# EasyEDA Pro project cartridge.epro

# Schematic Schematic1
Board Name: Board1; Create Date: 2025-01-17; Page Name: P1; Project Name: cartridge; Schematic Name: Schematic1; Update Date: 2025-01-17; Company: EasyEDA.com; Drawn: EasyEDA; Page Size: A4; Part Number: JLCPCB-002; Reviewed: EasyEDA; Version: V0.1
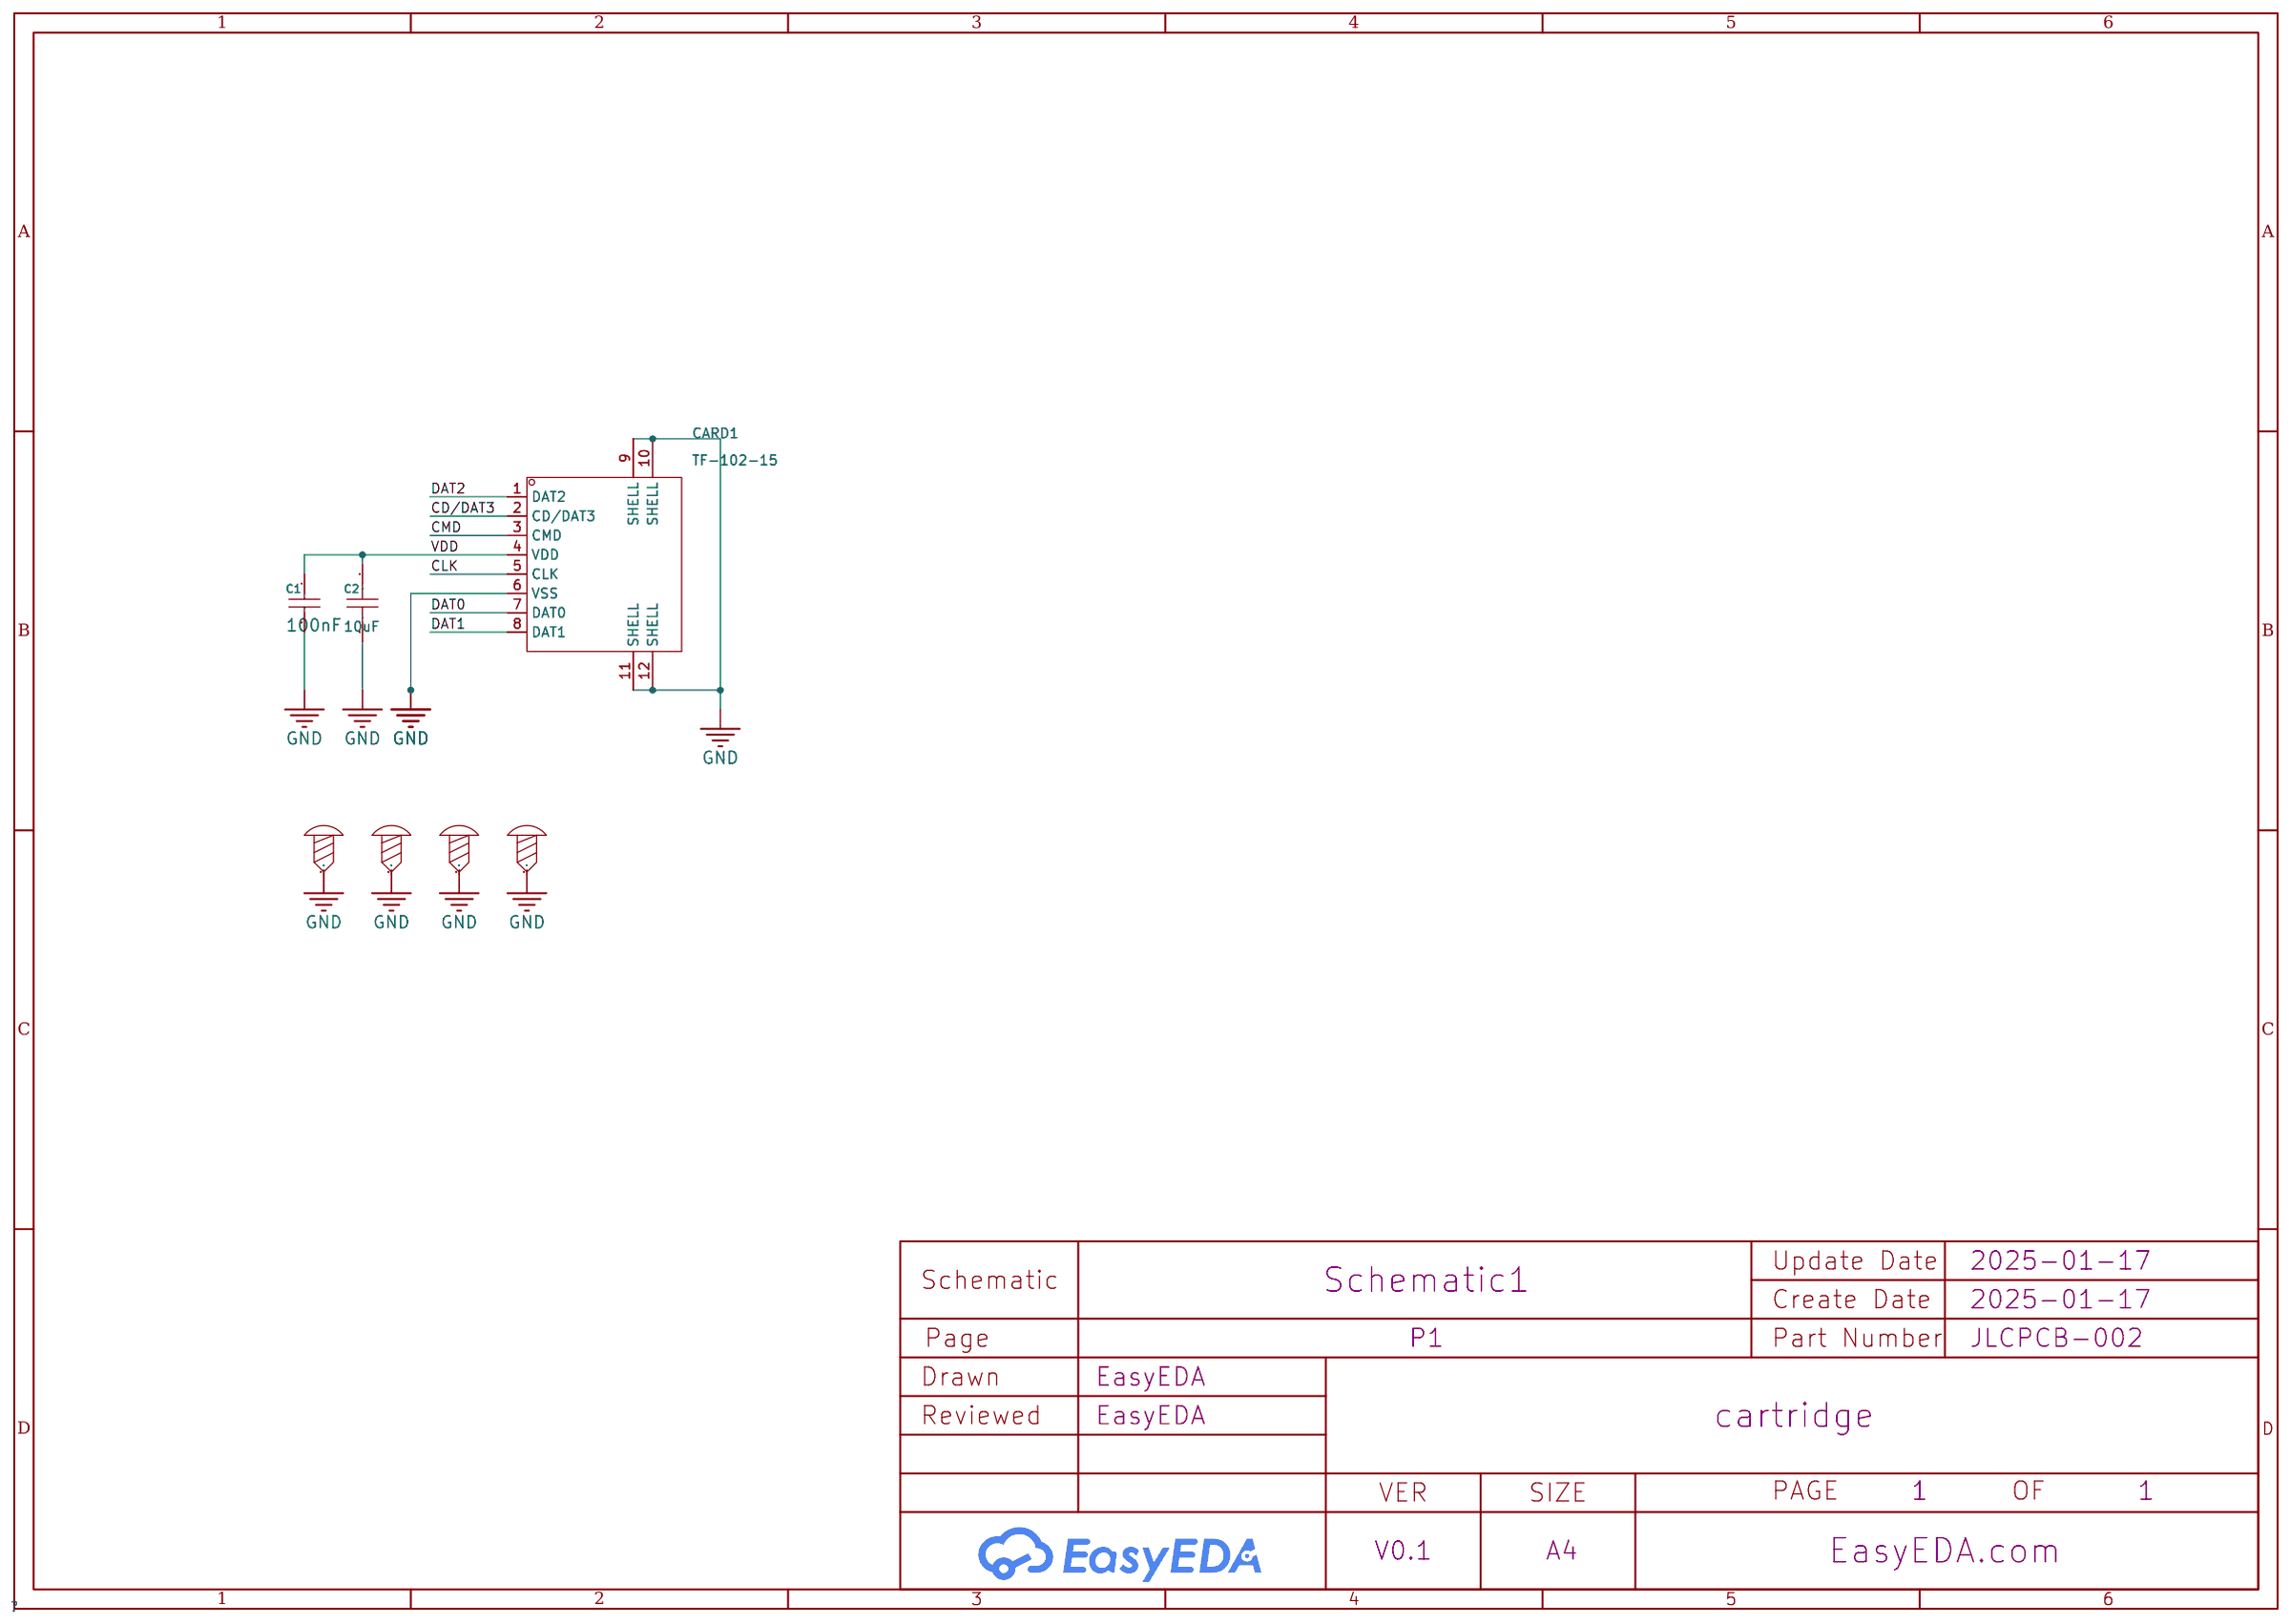
[diagram p0: schematic sheet]

## Parts
C1  100nF  [C0805]
C2  10uF  [C0805]
CARD1  TF-102-15  [TF-SMD_TF-102-15]
SCREW1  -  [Screw-Hole-M2]
SCREW2  -  [Screw-Hole-M2]
SCREW3  -  [Screw-Hole-M2]
SCREW4  -  [Screw-Hole-M2]

## Library data of the parts
C1 = CL21B104KBCNNNC: Capacitance: Tolerance:±10% Tolerance:±10% Voltage Rated: Temperature Coefficient:; LCSC Part Name: 100nF ±10% 50V; Supplier Part: C1711; Manufacturer: SAMSUNG(三星); Supplier Footprint: 0805; JLCPCB Part Class: Extended Part; Datasheet: https://atta.szlcsc.com/upload/public/pdf/source/20160218/1457707763339.pdf; Supplier: LCSC; Tolerance: ±10%
C2 = CL21A106KAYNNNE_C15850: Capacitance: Tolerance:±10% Tolerance:±10% Voltage Rated: Temperature Coefficient:; LCSC Part Name: 10uF ±10% 25V; Supplier Part: C15850; Manufacturer: SAMSUNG(三星); Manufacturer Part: CL21A106KAYNNNE; Supplier Footprint: 0805; JLCPCB Part Class: Basic Part; Datasheet: https://atta.szlcsc.com/upload/public/pdf/source/20160218/1457707763339.pdf; Supplier: LCSC; Tolerance: ±10%
CARD1 = TF-102-15: Card Connection Mode:Flip type Card Type:MicroSD card (TF card) Connector Type:Card Slot Additional Card Detection Pins:- Supplementary Features:- Maximum Body Height:1.6mm Operating Temperature Range:-25℃~+85℃ Operating Temperature Range:-25℃~+85℃; LCSC Part Name: 翻盖式 MicroSD卡(TF卡) 卡座; Supplier Part: C266609; Manufacturer: XUNPU(讯普); Supplier Footprint: SMD; JLCPCB Part Class: Extended Part; Datasheet: https://atta.szlcsc.com/upload/public/pdf/source/20210906/0DFE5F37C5A4FEB0620878352EFBDEA1.pdf; Supplier: LCSC; Card Connection Mode: Flip type; Card Type: MicroSD card (TF card); Connector Type: Card Slot; Maximum Body Height: 1.6mm; Operating Temperature Range: -25℃~+85℃
SCREW1-SCREW4 = Screw-Hole-M2: Supplier Footprint: 插件

## Nets
GND: C1.2 C2.1 CARD1.6(VSS) CARD1.9(SHELL) CARD1.10(SHELL) CARD1.11(SHELL) CARD1.12(SHELL) SCREW1.1 SCREW2.1 SCREW3.1 SCREW4.1
VDD: C1.1 C2.2 CARD1.4(VDD)
CD/DAT3: CARD1.2(CD/DAT3)
CLK: CARD1.5(CLK)
CMD: CARD1.3(CMD)
DAT0: CARD1.7(DAT0)
DAT1: CARD1.8(DAT1)
DAT2: CARD1.1(DAT2)

# Board PCB1
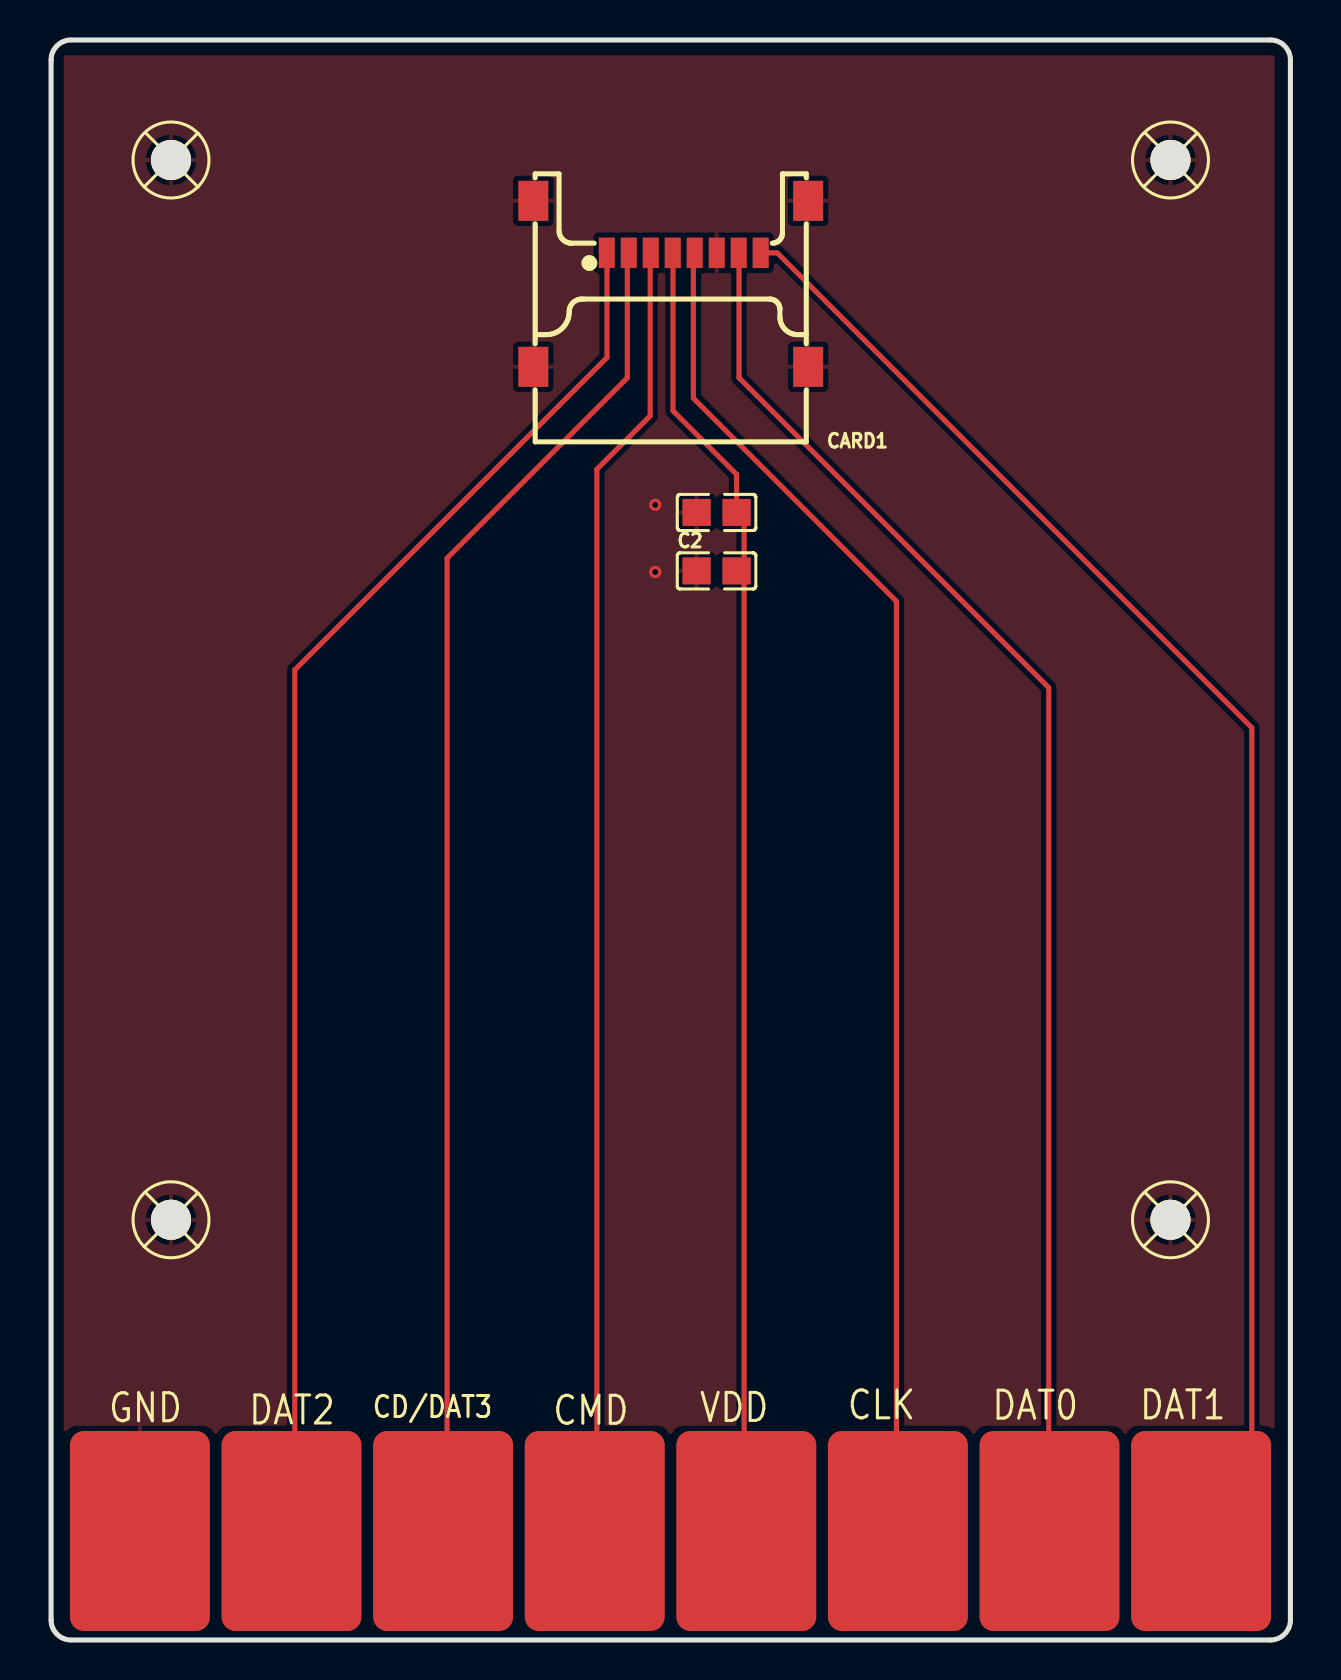
[diagram p1: board, top side]
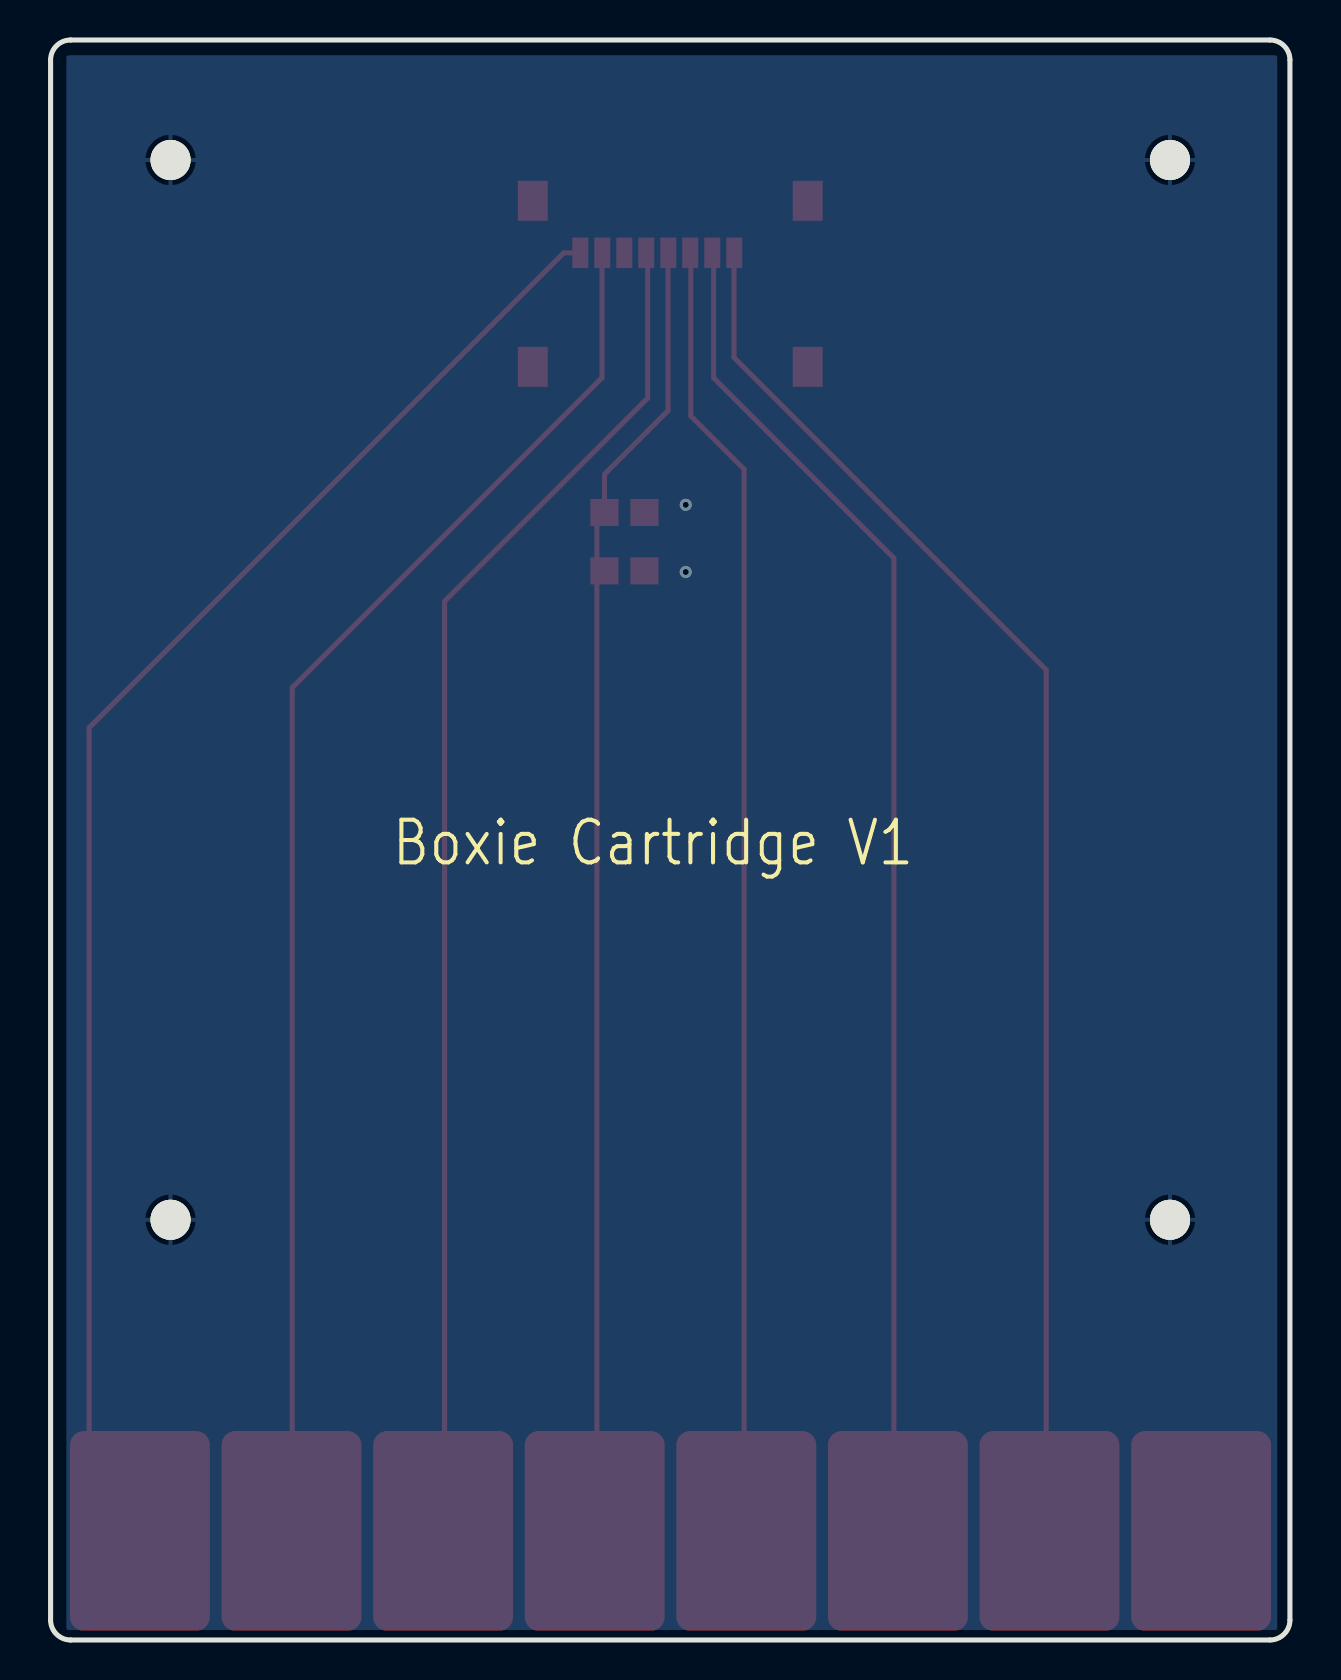
[diagram p2: board, bottom side, seen from below]

Outline 62 x 80 mm; copper layers: Top Layer, Bottom Layer. Coordinates in mm from the lower left corner of the outline.
Outline path: 0,79 0,1 arc(0.29,0.29) 1,0 61,0 arc(61.71,0.29) 62,1 62,79 arc(61.71,79.71) 61,80 1,80 arc(0.29,79.71) 0,79
Stack: Top Layer 0.035mm / Dielectric1 1.51mm FR4 er 4.5 / Bottom Layer 0.035mm

## Design rules (mm)
template: Custom Config
spacing copperThickness1oz (default): track to track 0.102, other pairs 0.152 to 0.3
spacing copperThickness2oz: track to track 0.203, other pairs 0.152 to 0.3
track width copperThickness1oz (default): min 0.127, default 0.254, max 2.54
track width copperThickness2oz: min 0.203, default 0.254, max 2.54
differential pair differentialPair (default): width min 0.127, default 0.254, max 2.54; gap min 0.152, default 0.152
via viaSize (default): diameter min 0.5, default 0.61, max 10; hole min 0.3, default 0.305, max 6.3

## Placement (name value [footprint] x y rotation side)
C1  100nF  [C0805]  33.29 56.38 180 top
C2  10uF  [C0805]  33.29 53.46 0 top
CARD1  TF-102-15  [TF-SMD_TF-102-15]  31 67.81 180 top
NOREF  -  [Pad_e147]  49.95 5.45 0 top
NOREF#2  -  [Pad_e144]  34.78 5.45 0 top
NOREF#3  -  [Pad_e148]  57.53 5.45 0 top
NOREF#4  -  [Pad_e142]  19.61 5.45 0 top
NOREF#5  -  [Pad_e141]  12.03 5.45 0 top
NOREF#6  -  [Pad_e143]  27.2 5.45 0 top
NOREF#7  -  [Pad_e39]  4.44 5.45 0 top
NOREF#8  -  [Pad_e145]  42.36 5.45 0 top
SCREW1  -  [Screw-Hole-M2]  6 74 0 top
SCREW2  -  [Screw-Hole-M2]  6 21.01 0 top
SCREW3  -  [Screw-Hole-M2]  56 74 0 top
SCREW4  -  [Screw-Hole-M2]  56 21.01 0 top

## Footprints (pads in the part's own frame, mm; a bottom-side part is the same pattern mirrored in y, then rotated)
C0805
  rect 1.41x1.35 smd: 1(-1,0) 2(1,0)
Pad_e39
  rrect 7x10 smd: (0,0)
Pad_e141
  rrect 7x10 smd: (0,0)
Pad_e142
  rrect 7x10 smd: (0,0)
Pad_e143
  rrect 7x10 smd: (0,0)
Pad_e144
  rrect 7x10 smd: (0,0)
Pad_e145
  rrect 7x10 smd: (0,0)
Pad_e147
  rrect 7x10 smd: (0,0)
Pad_e148
  rrect 7x10 smd: (0,0)
Screw-Hole-M2
  round 2 hole 2: 1(0,0)
TF-SMD_TF-102-15
  rect 0.8x1.524 smd: 1(3.2,-1.55) 2(2.1,-1.55) 3(1,-1.55) 4(-0.1,-1.55) 5(-1.2,-1.55) 6(-2.3,-1.55) 7(-3.4,-1.55) 8(-4.5,-1.55)
  rect 1.5x2 smd: 9(-6.875,4.15) 10(-6.875,-4.15) 11(6.875,4.15) 12(6.875,-4.15)

## Nets
GND: C1.2 C2.1 CARD1.6 CARD1.9 CARD1.10 CARD1.11 CARD1.12 NOREF#7. SCREW1.1 SCREW2.1 SCREW3.1 SCREW4.1
VDD: C1.1 C2.2 CARD1.4 NOREF#2.
CD/DAT3: CARD1.2 NOREF#4.
CLK: CARD1.5 NOREF#8.
CMD: CARD1.3 NOREF#6.
DAT0: CARD1.7 NOREF.
DAT1: CARD1.8 NOREF#3.
DAT2: CARD1.1 NOREF#5.

## Via types
v1: diameter 0.61, hole 0.305, Top Layer to Bottom Layer, 2 vias

## Routing (per net, layer and track width the routed paths; a pad name or vN(x,y) marks a point on that pad's centre or on a via; arc(x,y) is an arc through that point)
GND:
  vias: v1(30.23,56.76) v1(30.23,53.4)
VDD: length 65.2
  Top Layer w0.254: 34.35,5.36 34.17,5.54 ; 31.12,69.03 31.12,61.46 34.29,58.28 34.29,56.38 C1.1 ; 34.29,56.13 34.67,55.75 34.67,5.71 34.42,5.45
CD/DAT3: length 67.6
  Top Layer w0.254: 28.83,69.11 28.83,63.11 19.81,54.09 19.81,5.83 19.43,5.45
CLK: length 68
  Top Layer w0.254: 32.13,69.11 32.13,62.09 42.29,51.93 42.29,5.83 41.91,5.45
CMD: length 64.9
  Top Layer w0.254: 29.97,69.07 29.97,61.2 27.31,58.54 27.31,5.83 26.92,5.45
DAT0: length 70.2
  Top Layer w0.254: 49.4,5.45 49.91,5.96 49.91,47.61 34.42,63.11 34.42,69.02
DAT1: length 77.4
  Top Layer w0.254: CARD1.8 36.33,69.36 60.07,45.61 60.07,6.09 59.94,5.96 57.4,5.96 56.9,5.45
DAT2: length 70.2
  Top Layer w0.254: 11.94,5.45 12.19,5.71 12.19,48.5 27.81,64.12 27.81,69.03

## Copper pours and planes (outline as drawn; the poured copper is in the pictures)
GND on Top Layer: 0.64,79.24 61.21,79.24 61.21,0.5 0.64,0.5
GND on Bottom Layer: 0.64,79.24 61.21,79.24 61.21,0.5 0.64,0.5

## Text on the board
Bottom Silkscreen Layer: Boxie Cartridge V1
Top Silkscreen Layer: CD/DAT3 | GND | DAT2 | CMD | VDD | CLK | DAT0 | DAT1
